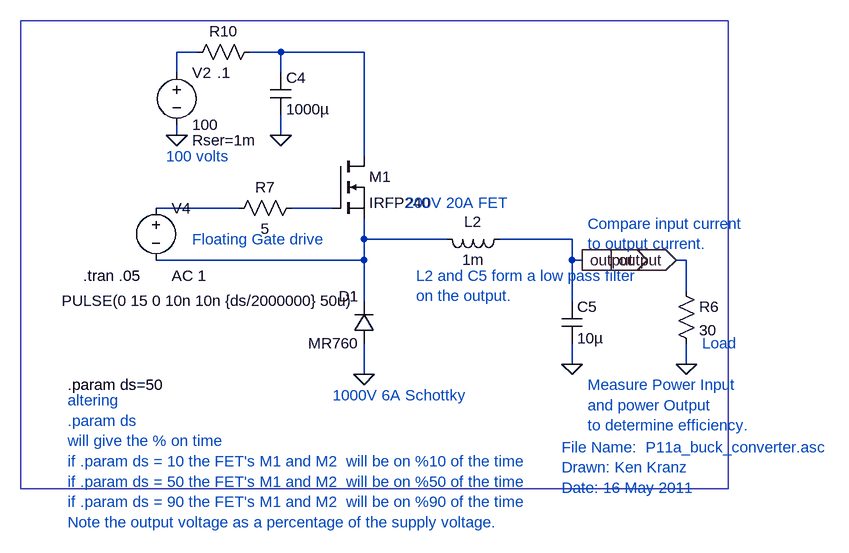
[diagram p0: schematic P11a_buck_converter.asc]
P11a_buck_converter.asc, the LTspice schematic file:
Version 4
SHEET 1 3564 2068
WIRE 2272 992 2240 992
WIRE 2400 992 2352 992
WIRE 2528 992 2400 992
WIRE 2240 1024 2240 992
WIRE 2400 1024 2400 992
WIRE 2240 1120 2240 1104
WIRE 2400 1120 2400 1088
WIRE 2528 1152 2528 992
WIRE 2336 1232 2208 1232
WIRE 2480 1232 2416 1232
WIRE 2528 1280 2528 1248
WIRE 2656 1280 2528 1280
WIRE 2848 1280 2736 1280
WIRE 2528 1312 2528 1280
WIRE 2528 1312 2208 1312
WIRE 2848 1312 2848 1280
WIRE 2864 1312 2848 1312
WIRE 3024 1312 3008 1312
WIRE 3024 1360 3024 1312
WIRE 2528 1376 2528 1312
WIRE 2848 1376 2848 1312
WIRE 2848 1472 2848 1440
WIRE 3024 1472 3024 1440
WIRE 2528 1488 2528 1440
FLAG 2240 1120 0
FLAG 2400 1120 0
FLAG 2848 1472 0
FLAG 3024 1472 0
FLAG 2864 1312 output
IOPIN 2864 1312 Out
FLAG 3008 1312 output
IOPIN 3008 1312 In
FLAG 2528 1488 0
SYMBOL voltage 2208 1216 R0
WINDOW 123 24 120 Left 0
WINDOW 39 0 0 Left 0
WINDOW 3 -145 159 Left 0
SYMATTR Value2 AC 1
SYMATTR Value PULSE(0 15 0 10n 10n {ds/2000000} 50u)
SYMATTR InstName V4
SYMBOL cap 2384 1024 R0
SYMATTR InstName C4
SYMATTR Value 1000µ
SYMBOL cap 2832 1376 R0
SYMATTR InstName C5
SYMATTR Value 10µ
SYMBOL voltage 2240 1008 R0
WINDOW 123 0 0 Left 0
WINDOW 39 24 120 Left 0
SYMATTR SpiceLine Rser=1m
SYMATTR InstName V2
SYMATTR Value 100
SYMBOL ind 2752 1264 R90
WINDOW 0 5 56 VBottom 0
WINDOW 3 32 56 VTop 0
SYMATTR InstName L2
SYMATTR Value 1m
SYMATTR SpiceLine Rser=.01
SYMBOL res 3008 1344 R0
SYMATTR InstName R6
SYMATTR Value 30
SYMBOL nmos 2480 1152 R0
SYMATTR InstName M1
SYMATTR Value IRFP240
SYMBOL res 2432 1216 R90
WINDOW 0 0 56 VBottom 0
WINDOW 3 32 56 VTop 0
SYMATTR InstName R7
SYMATTR Value 5
SYMBOL res 2368 976 R90
WINDOW 0 0 56 VBottom 0
WINDOW 3 32 56 VTop 0
SYMATTR InstName R10
SYMATTR Value .1
SYMBOL diode 2544 1440 R180
WINDOW 0 24 72 Left 0
WINDOW 3 24 0 Left 0
SYMATTR InstName D1
SYMATTR Value MR760
TEXT 2096 1336 Left 0 !.tran .05
TEXT 3048 1440 Left 0 ;Load
TEXT 2072 1504 Left 0 !.param ds=50
TEXT 2072 1528 Left 0 ;altering\n.param ds \nwill give the % on time\nif .param ds = 10 the FET's M1 and M2  will be on %10 of the time\nif .param ds = 50 the FET's M1 and M2  will be on %50 of the time\nif .param ds = 90 the FET's M1 and M2  will be on %90 of the time\nNote the output voltage as a percentage of the supply voltage.
TEXT 2832 1600 Left 0 ;File Name:  P11a_buck_converter.asc\nDrawn: Ken Kranz\nDate: 16 May 2011
TEXT 2608 1336 Left 0 ;L2 and C5 form a low pass filter\non the output.
TEXT 2872 1504 Left 0 ;Measure Power Input \nand power Output\nto determine efficiency.
TEXT 2264 1280 Left 0 ;Floating Gate drive
TEXT 2480 1520 Left 0 ;1000V 6A Schottky
TEXT 2592 1224 Left 0 ;200V 20A FET
TEXT 2224 1152 Left 0 ;100 volts
TEXT 2872 1256 Left 0 ;Compare input current\nto output current.
RECTANGLE Normal 3088 1664 2000 944

The netlist it stands for:
* P11a_buck_converter.asc
V4 N003 N005 PULSE(0 15 0 10n 10n {ds/2000000} 50u) AC 1
C4 N002 0 1000µ
C5 output 0 10µ
V2 N001 0 100 Rser=1m
L2 output N005 1m Rser=.01
R6 output 0 30
M1 N002 N004 N005 N005 IRFP240
R7 N004 N003 5
R10 N002 N001 .1
D1 0 N005 MR760
.model D D
.lib standard.dio
.model NMOS NMOS
.model PMOS PMOS
.lib standard.mos
.tran .05
* Load
.param ds=50
* altering
* .param ds
* will give the % on time
* if .param ds = 10 the FET's M1 and M2  will be on %10 of the time
* if .param ds = 50 the FET's M1 and M2  will be on %50 of the time
* if .param ds = 90 the FET's M1 and M2  will be on %90 of the time
* Note the output voltage as a percentage of the supply voltage.
* File Name:  P11a_buck_converter.asc
* Drawn: Ken Kranz
* Date: 16 May 2011
* L2 and C5 form a low pass filter
* on the output.
* Measure Power Input
* and power Output
* to determine efficiency.
* Floating Gate drive
* 1000V 6A Schottky
* 200V 20A FET
* 100 volts
* Compare input current
* to output current.
.backanno
.end